# Altium schematic sheet LVDS_bridge_link.SchDoc
size A3; SheetNumber: 2; SheetTotal: 2
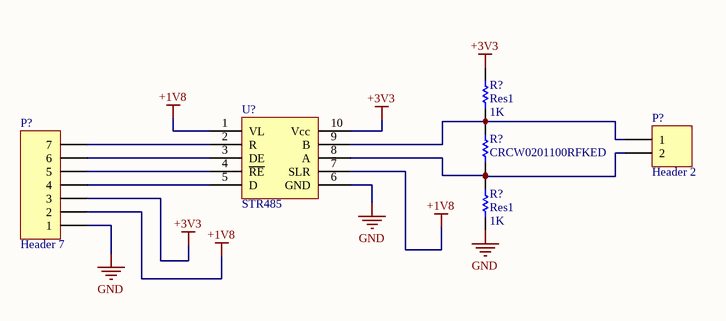
[diagram p0: LVDS_bridge_link.SchDoc]

## Parts
(Parts that share a designator on the sheet are numbered #1, #2 ... from top to bottom, then left to right.)
P?#1  Header 2  [HDR1X2]
P?#2  Header 7  [HDR1X7]
R?#1  Res1  value 1K  [AXIAL-0.3]
R?#2  CRCW0201100RFKED  [RESC0603X28X15ML05T05]
R?#3  Res1  value 1K  [AXIAL-0.3]
U?  STR485  [STR485LVQT]

## Nets
+1V8: P?#2.2 U?.1(VL) U?.7(SLR)
+3V3: P?#2.3 R?#1.2 U?.10(Vcc)
GND: P?#2.1 R?#3.1 U?.6(GND)
NetP?#1_1: P?#1.1 R?#1.1 R?#2.2 U?.9(B)
NetP?#1_2: P?#1.2 R?#2.1 R?#3.2 U?.8(A)
NetP?#2_4: P?#2.4 U?.5(D)
NetP?#2_5: P?#2.5 U?.4(~{RE})
NetP?#2_6: P?#2.6 U?.3(DE)
NetP?#2_7: P?#2.7 U?.2(R)

## Library data of the parts
P?#1 = Header 2: Header, 2-Pin; LatestRevisionDate: 17-Jul-2002; LatestRevisionNote: Re-released for DXP Platform.; Publisher: Altium Limited
P?#2 = Header 7: Header, 7-Pin; LatestRevisionDate: 17-Jul-2002; LatestRevisionNote: Re-released for DXP Platform.; Publisher: Altium Limited
R?#1 R?#3 = Res1: Resistor; Published: 8-Jun-2000; LatestRevisionDate: 17-Jul-2002; LatestRevisionNote: Re-released for DXP Platform.; PackageReference: AXIAL-0.3; Publisher: Altium Limited; PackageDescription: Axial Device, Thru-Hole; 2 Leads; 0.3 in Pin Spacing
R?#2 = CMP-2004-00005-1: Manufacturer: Vishay; Part Number: CRCW0201100RFKED
U? = STR485: 3.3 V LVDS RS485 compatible with 1.8 V I/Os and selectable speed